# EAGLE design RxT6 (EAGLE 4.13)
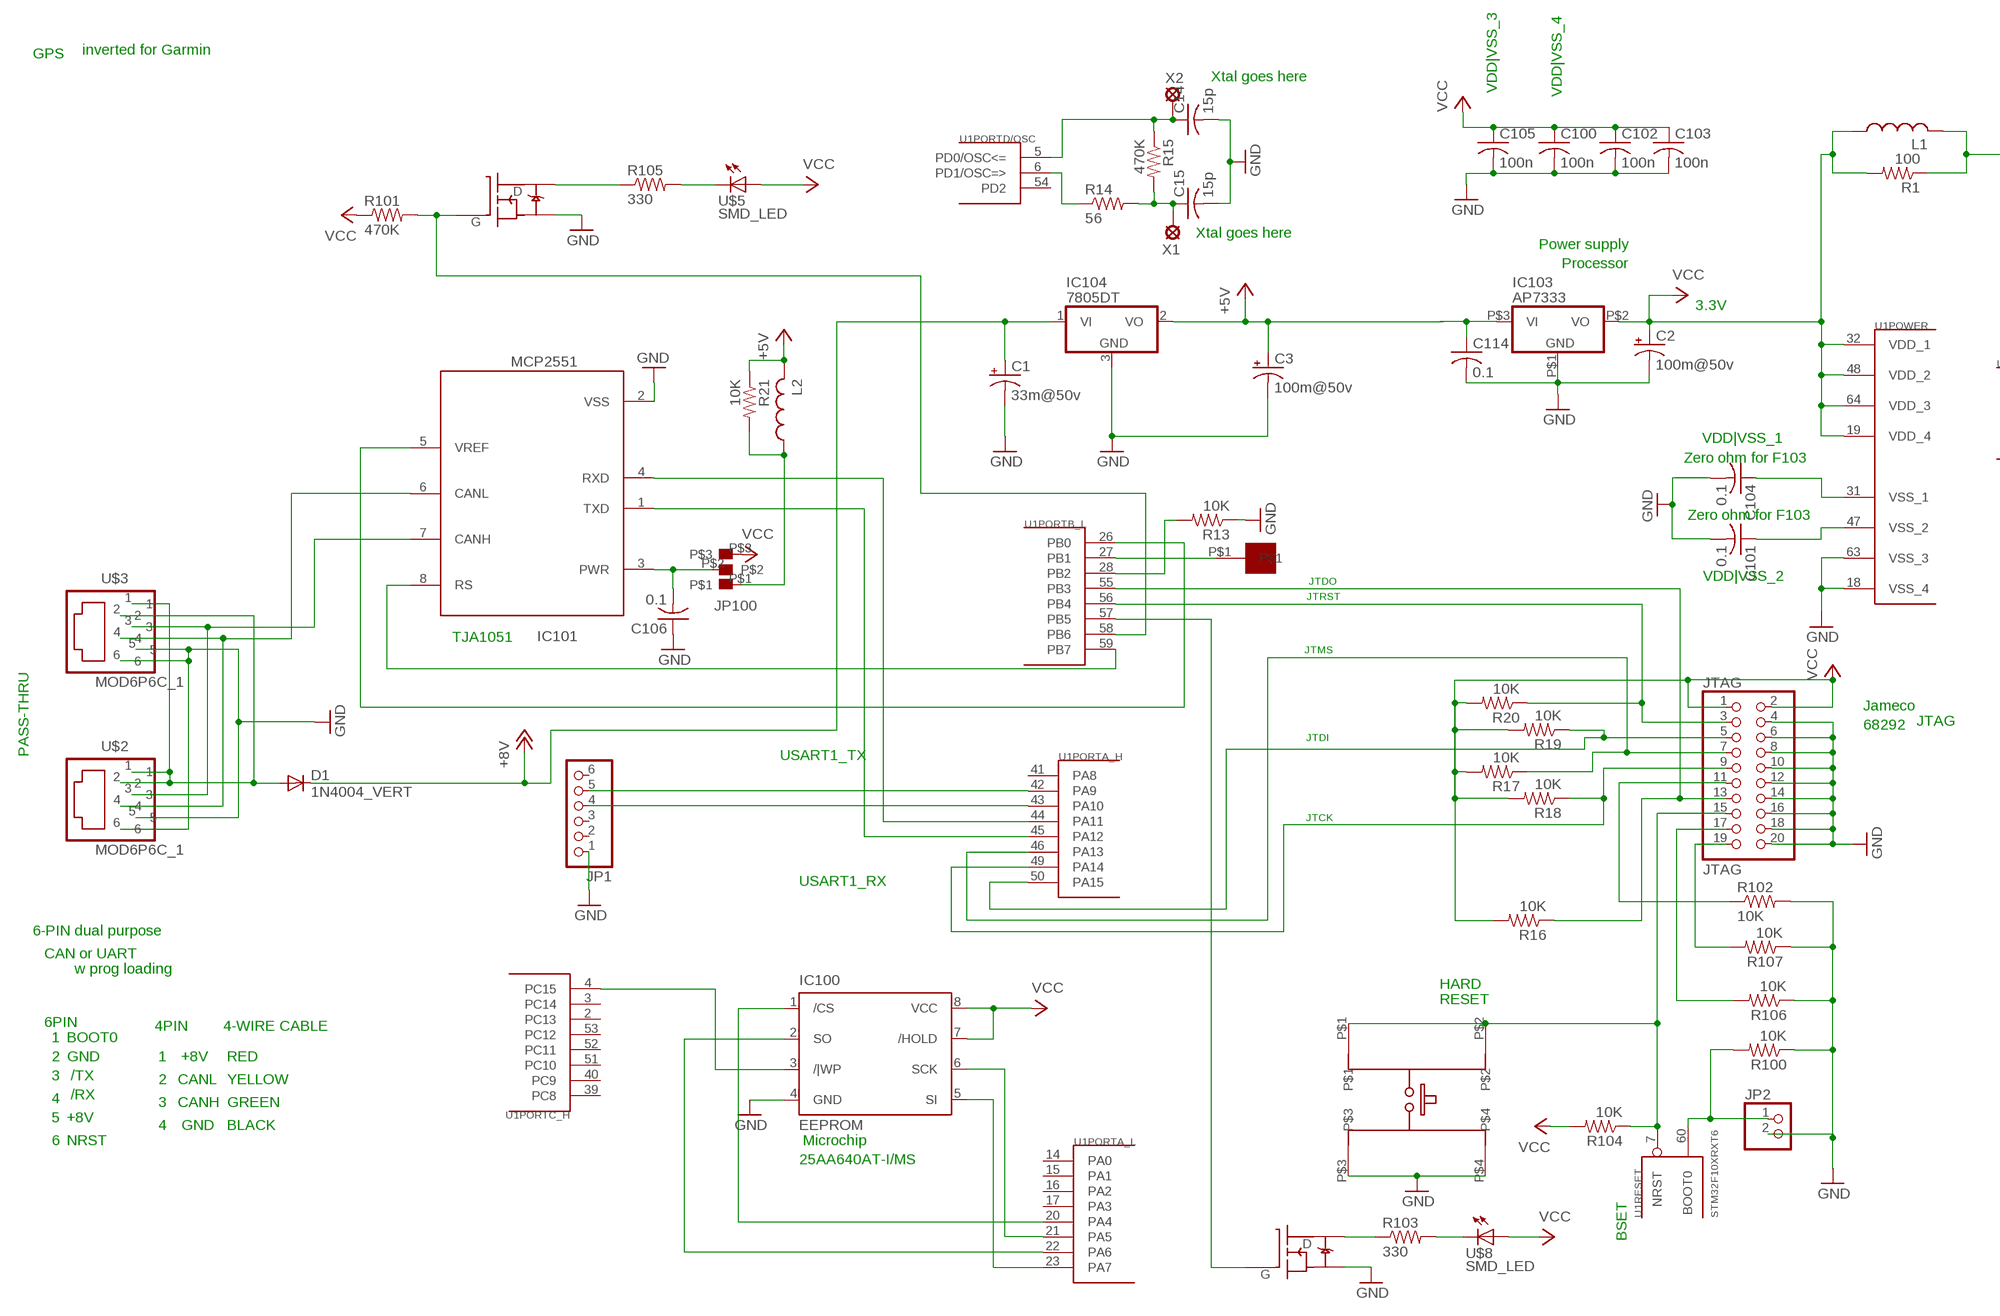
[diagram p0: schematic, sheet 1, part 1 of 2]
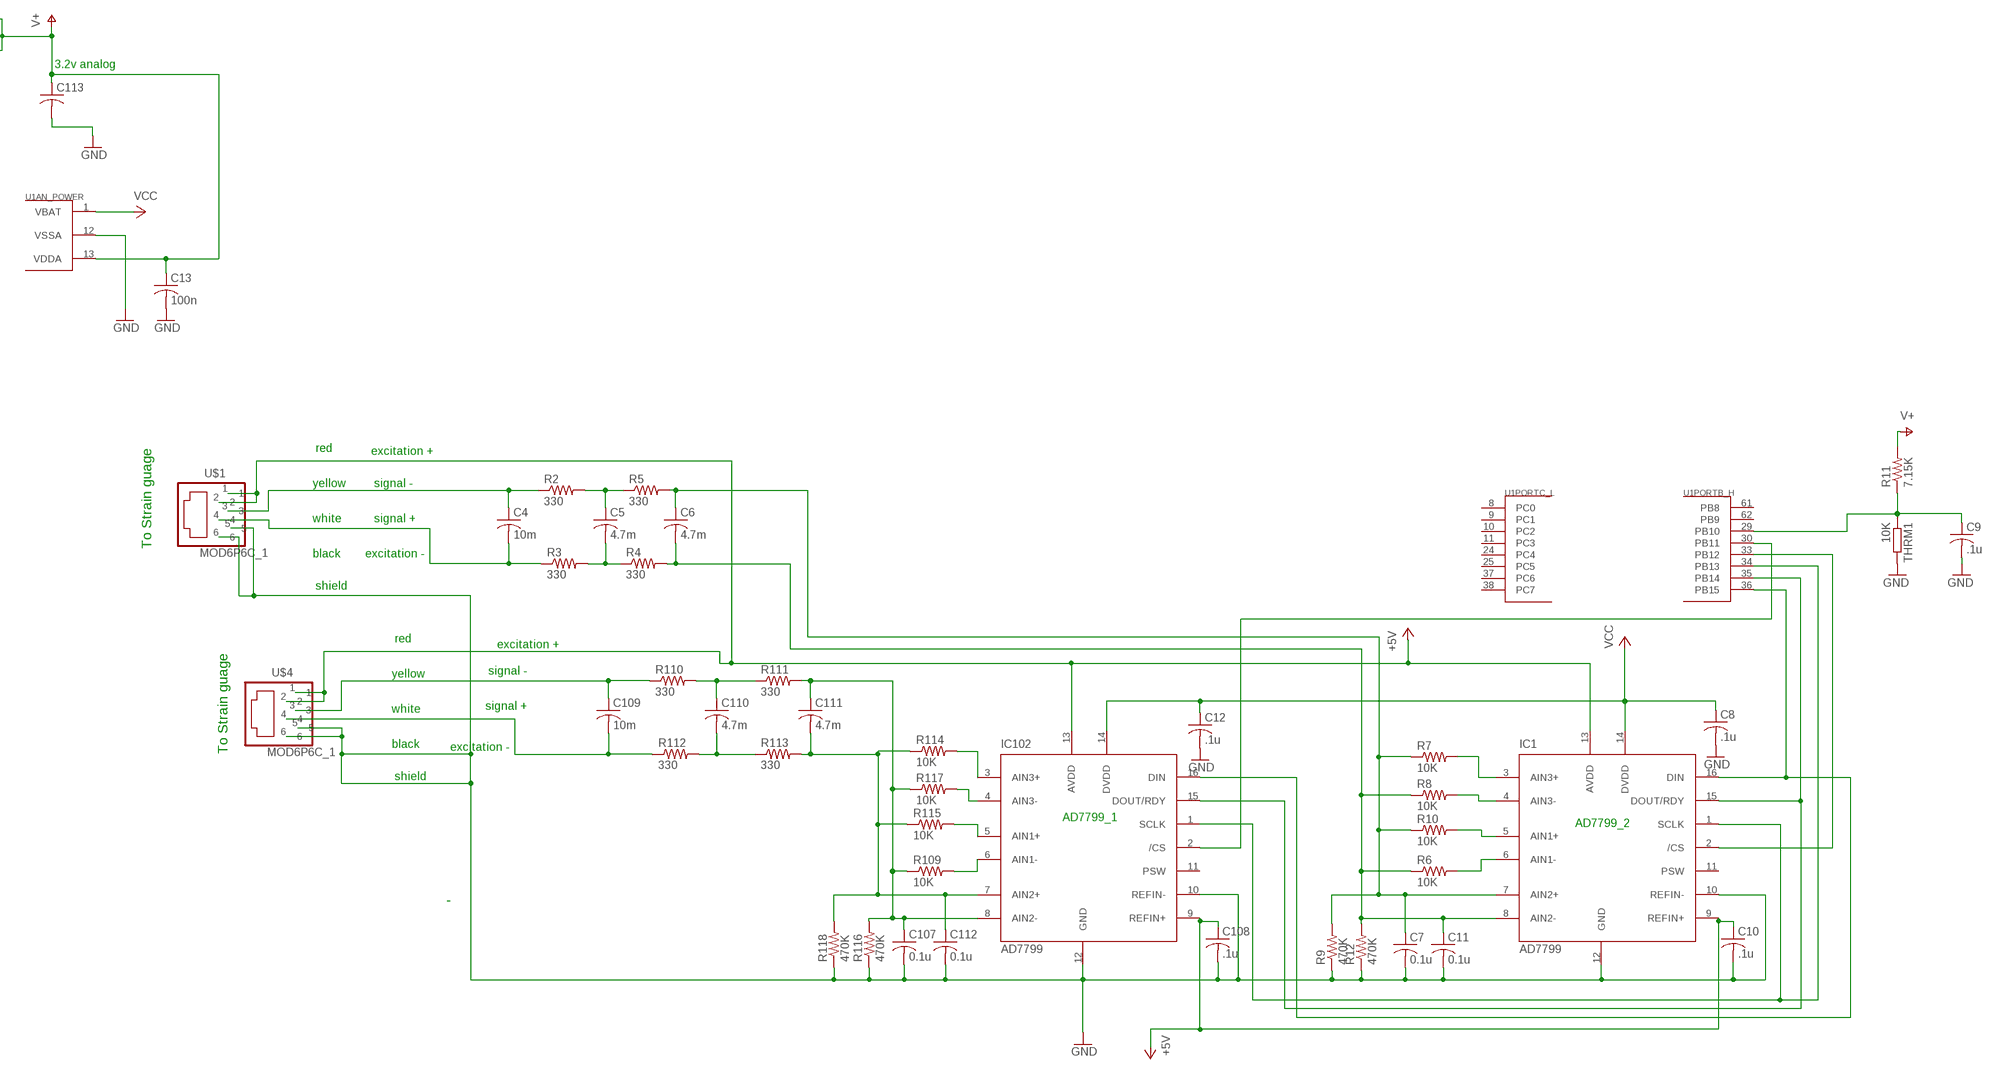
[diagram p1: schematic, sheet 1, part 2 of 2]

## Parts
C1  33m@50v  CPOL-USE5-6  [E5-6]
C2  100m@50v  CPOL-USE5-8.5  [E5-8,5]
C3  100m@50v  CPOL-USE5-8.5  [E5-8,5]
C4  10m  C-USC0805  [C0805]
C5  4.7m  C-USC0805  [C0805]
C6  4.7m  C-USC0805  [C0805]
C7  0.1u  C-USC0603  [C0603]
C8  .1u  C-USC0603  [C0603]
C9  .1u  C-USC0603  [C0603]
C10  .1u  C-USC0603  [C0603]
C11  0.1u  C-USC0603  [C0603]
C12  .1u  C-USC0603  [C0603]
C13  100n  C-USC0603  [C0603]
C14  15p  C-USC0603  [C0603]
C15  15p  C-USC0603  [C0603]
C100  100n  C-USC0603  [C0603]
C101  0.1  C-USC0603  [C0603]
C102  100n  C-USC0603  [C0603]
C103  100n  C-USC0603  [C0603]
C104  0.1  C-USC0603  [C0603]
C105  100n  C-USC0603  [C0603]
C106  0.1  C-USC0603  [C0603]
C107  0.1u  C-USC0603  [C0603]
C108  .1u  C-USC0603  [C0603]
C109  10m  C-USC0805  [C0805]
C110  4.7m  C-USC0805  [C0805]
C111  4.7m  C-USC0805  [C0805]
C112  0.1u  C-USC0603  [C0603]
C113  C-USC0603  [C0603]
C114  0.1  C-USC0603  [C0603]
D1  1N4004_VERT  [DO41-10_VERT]
IC1  AD7799  [TSSPO16]
IC100  EEPROM  [TSSOP8]
IC101  MCP2551  [SO-08]
IC102  AD7799  [TSSPO16]
IC103  AP7333  MCP1702  [SOT-23A]
IC104  7805DT  [TO252]
JP1  PINHD-1X6  [1X06]
JP2  PINHD-1X2  [1X02]
JP100  SMD-3  [SMD_3]
JTAG  JTAG  PINHD-2X10_KEYED  [2X10_KEYED]
L1  L-USL1812  [L1812]
L2  L-USL1812  [L1812]
Q100  IRLML2060  [SOT-23]
Q101  IRLML2060  [SOT-23]
R1  100  R-US_R0603  [R0603]
R2  330  R-US_R0603  [R0603]
R3  330  R-US_R0603  [R0603]
R4  330  R-US_R0603  [R0603]
R5  330  R-US_R0603  [R0603]
R6  10K  R-US_R0603  [R0603]
R7  10K  R-US_R0603  [R0603]
R8  10K  R-US_R0603  [R0603]
R9  470K  R-US_R0603  [R0603]
R10  10K  R-US_R0603  [R0603]
R11  7.15K  R-US_R0603  [R0603]
R12  470K  R-US_R0603  [R0603]
R13  10K  R-US_R0603  [R0603]
R14  56  R-US_R0603  [R0603]
R15  470K  R-US_R0603  [R0603]
R16  10K  R-US_R0603  [R0603]
R17  10K  R-US_R0603  [R0603]
R18  10K  R-US_R0603  [R0603]
R19  10K  R-US_R0603  [R0603]
R20  10K  R-US_R0603  [R0603]
R21  10K  R-US_R0603  [R0603]
R100  10K  R-US_R0603  [R0603]
R101  470K  R-US_R0603  [R0603]
R102  10K  R-US_R0603  [R0603]
R103  330  R-US_R0603  [R0603]
R104  10K  R-US_R0603  [R0603]
R105  330  R-US_R0603  [R0603]
R106  10K  R-US_R0603  [R0603]
R107  10K  R-US_R0603  [R0603]
R109  10K  R-US_R0603  [R0603]
R110  330  R-US_R0603  [R0603]
R111  330  R-US_R0603  [R0603]
R112  330  R-US_R0603  [R0603]
R113  330  R-US_R0603  [R0603]
R114  10K  R-US_R0603  [R0603]
R115  10K  R-US_R0603  [R0603]
R116  470K  R-US_R0603  [R0603]
R117  10K  R-US_R0603  [R0603]
R118  470K  R-US_R0603  [R0603]
S1  SMD_1  [SMD_1]
SW1  E-SWITCH  [E-SWITCH]
THRM1  10K  R-EU_R0603  [R0603]
U1  STM32F10XRXT6  [TQFP64]
U$1  MOD6P6C_1  [MOD6P6C_1]
U$2  MOD6P6C_1  [MOD6P6C_1]
U$3  MOD6P6C_1  [MOD6P6C_1]
U$4  MOD6P6C_1  [MOD6P6C_1]
U$5  SMD_LED  [SMD_LED]
U$8  SMD_LED  [SMD_LED]
X1  SOLPAD035  [SOLDPAD035]
X2  SOLPAD035  [SOLDPAD035]

## Nets
+5V: C3.+ C10.1 C108.1 C114.1 IC1.9(REFIN+) IC1.13(AVDD) IC102.9(REFIN+) IC102.13(AVDD) IC103.P$3(VI) IC104.2(VO) L2.2 R21.1 U$1.1 U$1.2 U$4.1 U$4.2
+8V: C1.+ D1.C IC104.1(VI)
+V_RAW: D1.A U$2.1 U$2.2 U$3.1 U$3.2
AD7799_1_AIN1+: IC102.5(AIN1+) R115.2
AD7799_1_AIN1-: IC102.6(AIN1-) R109.2
AD7799_2_AIN1+: IC1.5(AIN1+) R10.2
AD7799_2_AIN1-: IC1.6(AIN1-) R6.2
AD7799_2_AIN3+: IC1.3(AIN3+) R7.2
AD7799_2_AIN3-: IC1.4(AIN3-) R8.2
BOOT0: JP2.1 R100.2 U1.60(RESET:BOOT0)
BRDIGE1_YELLOW_AIN1-: C107.1 C111.1 IC102.8(AIN2-) R109.1 R111.2 R116.2 R117.1
BRDIGE2_YELLOW_AIN1+: C6.1 C7.1 IC1.7(AIN2+) R5.2 R7.1 R9.2 R10.1
BRIDGE1_FILTER+_2: C110.2 R112.2 R113.1
BRIDGE1_FILTER-_2: C110.1 R110.2 R111.1
BRIDGE1_WHITE_AIN2+: C111.2 C112.1 IC102.7(AIN2+) R113.2 R114.1 R115.1 R118.2
BRIDGE1_WHITE_SIG+: C109.2 R112.1 U$4.4
BRIDGE1_YELLOW_SIG-: C109.1 R110.1 U$4.3
BRIDGE2_FILTER+_2: C5.2 R3.2 R4.1
BRIDGE2_FILTER-_2: C5.1 R2.2 R5.1
BRIDGE2_WHITE_AIN1-: C6.2 C11.1 IC1.8(AIN2-) R4.2 R6.1 R8.1 R12.2
BRIDGE2_WHITE_SIG+: C4.2 R3.1 U$1.4
BRIDGE2_YELLOW_SIG-: C4.1 R2.1 U$1.3
CAN_PWR: C106.2 IC101.3(PWR) JP100.P$2
CANH: IC101.7(CANH) U$2.3 U$3.3
CANL: IC101.6(CANL) U$2.4 U$3.4
EEPROM_/WP: IC100.3(/|WP) U1.4(PORTC_H:PC15)
GND: C1.- C2.- C3.- C7.2 C8.2 C9.2 C10.2 C11.2 C12.2 C13.2 C14.2 C15.2 C100.2 C101.2 C102.2 C103.2 C104.2 C105.2 C106.1 C107.2 C108.2 C112.2 C113.2 C114.2 IC1.10(REFIN-) IC1.12(GND) IC100.4(GND) IC101.2(VSS) IC102.10(REFIN-) IC102.12(GND) IC103.P$1(GND) IC104.3(GND) JP1.1 JP2.2 JTAG.4 JTAG.6 JTAG.8 JTAG.10 JTAG.12 JTAG.14 JTAG.16 JTAG.18 JTAG.20 Q100.2(S) Q101.2(S) R9.1 R12.1 R13.1 R100.1 R102.2 R106.1 R107.1 R116.1 R118.1 SW1.P$3 SW1.P$4 THRM1.2 U1.12(AN_POWER:VSSA) U1.18(POWER:VSS_4) U1.63(POWER:VSS_3) U$1.5 U$1.6 U$2.5 U$2.6 U$3.5 U$3.6 U$4.5 U$4.6
JTAG_R-TO-GND-11: JTAG.11 R102.1
JTAG_R-TO-GND-17: JTAG.17 R106.2
JTAG_R-TO-GND-19: JTAG.19 R107.2
JTDO: JTAG.13 R16.1 U1.55(PORTB_L:PB3)
JTRST: JTAG.3 R20.1 U1.56(PORTB_L:PB4)
N$1: IC102.4(AIN3-) R117.2
N$2: IC102.3(AIN3+) R114.2
N$3: JP100.P$1 L2.1 R21.2
NRST: JTAG.15 R104.1 SW1.P$1 SW1.P$2 U1.7(RESET:NRST)
PA3_ADC123_IN3|THERMISTOR_32KHZ: C9.1 R11.1 THRM1.1 U1.29(PORTB_H:PB10)
PA4_EEPROM_/CS: IC100.1(/CS) U1.20(PORTA_L:PA4)
PA5_EEPROM_SCK: IC100.6(SCK) U1.21(PORTA_L:PA5)
PA6_EEPROM_SI: IC100.5(SI) U1.23(PORTA_L:PA7)
PA7_EEPROM_SO: IC100.2(SO) U1.22(PORTA_L:PA6)
PA9_USART1_TX: JP1.5 U1.42(PORTA_H:PA9)
PA10_USART1_RX: JP1.4 U1.43(PORTA_H:PA10)
PA11_CANRXD: IC101.4(RXD) U1.44(PORTA_H:PA11)
PA12_CANTXD: IC101.1(TXD) U1.45(PORTA_H:PA12)
PA13_JTIMS: JTAG.7 R17.1 U1.46(PORTA_H:PA13)
PA14_JTCK: JTAG.9 R18.1 U1.49(PORTA_H:PA14)
PA15_JTDI: JTAG.5 R19.1 U1.50(PORTA_H:PA15)
PAB13_SPI2_SCK_AD7799_SCK: IC1.1(SCLK) IC102.1(SCLK) U1.34(PORTB_H:PB13)
PB0_CAN_VREF: IC101.5(VREF) U1.26(PORTB_L:PB0)
PB1: S1.P$1 U1.27(PORTB_L:PB1)
PB2_BOOT1: R13.2 U1.28(PORTB_L:PB2)
PB5_LED: Q100.1(G) U1.57(PORTB_L:PB5)
PB6_LED_GREEN: Q101.1(G) R101.2 U1.58(PORTB_L:PB6)
PB7_CAN_RS: IC101.8(RS) U1.59(PORTB_L:PB7)
PB11_AD7799_1_/CS: IC102.2(/CS) U1.30(PORTB_H:PB11)
PB12_AD7799_2_/CS: IC1.2(/CS) U1.33(PORTB_H:PB12)
PB14_SPI2_MISO_AD7799_DOUT/RDY: IC1.15(DOUT/RDY) IC102.15(DOUT/RDY) U1.35(PORTB_H:PB14)
PB15_PWRLED: R105.2 U$5.C
PB15_PWRLED_D: Q101.3(D) R105.1
PB15_SPI1_MOSI_AD7799_DIN: IC1.16(DIN) IC102.16(DIN) U1.36(PORTB_H:PB15)
PC5_LED2: R103.2 U$8.C
PC5_LED_D: Q100.3(D) R103.1
PD0_OSC_IN_XTAL: C14.1 R15.1 U1.5(PORTD/OSC:PD0/OSC<=) X2.MP
PD1_OSC_OUT: R14.1 U1.6(PORTD/OSC:PD1/OSC=>)
PD1_OSC_OUT_XTAL: C15.1 R14.2 R15.2 X1.MP
V+: C13.1 C113.1 L1.2 R1.1 R11.2 U1.13(AN_POWER:VDDA)
VCC: C2.+ C8.1 C12.1 C100.1 C102.1 C103.1 C105.1 IC1.14(DVDD) IC100.7(/HOLD) IC100.8(VCC) IC102.14(DVDD) IC103.P$2(VO) JP100.P$3 JTAG.1 JTAG.2 L1.1 R1.2 R16.2 R17.2 R18.2 R19.2 R20.2 R101.1 R104.2 U1.1(AN_POWER:VBAT) U1.19(POWER:VDD_4) U1.32(POWER:VDD_1) U1.48(POWER:VDD_2) U1.64(POWER:VDD_3) U$5.A U$8.A
VSS_1: C104.1 U1.31(POWER:VSS_1)
VSS_2: C101.1 U1.47(POWER:VSS_2)
Unconnected: IC1.11(PSW) IC102.11(PSW) JP1.2 JP1.3 JP1.6 U1.2(PORTC_H:PC13) U1.3(PORTC_H:PC14) U1.8(PORTC_L:PC0) U1.9(PORTC_L:PC1) U1.10(PORTC_L:PC2) U1.11(PORTC_L:PC3) U1.14(PORTA_L:PA0) U1.15(PORTA_L:PA1) U1.16(PORTA_L:PA2) U1.17(PORTA_L:PA3) U1.24(PORTC_L:PC4) U1.25(PORTC_L:PC5) U1.37(PORTC_L:PC6) U1.38(PORTC_L:PC7) U1.39(PORTC_H:PC8) U1.40(PORTC_H:PC9) U1.41(PORTA_H:PA8) U1.51(PORTC_H:PC10) U1.52(PORTC_H:PC11) U1.53(PORTC_H:PC12) U1.54(PORTD/OSC:PD2) U1.61(PORTB_H:PB8) U1.62(PORTB_H:PB9)

## Notes on the sheet
- GPS | inverted for Garmin
- Xtal goes here
- VDD|VSS_3 | VDD|VSS_4
- 3.2v analog
- Xtal goes here
- Power supply
- Processor
- 3.3V
- VDD|VSS_1
- Zero ohm for F103
- Zero ohm for F103
- JTDO
- VDD|VSS_2
- JTRST
- TJA1051
- JTMS
- red | excitation +
- Jameco
- 68292 | JTAG
- JTDI
- yellow | signal -
- PASS-THRU | USART1_TX
- white | signal +
- JTCK
- To Strain guage
- black | excitation -
- shield
- USART1_RX
- 6-PIN dual purpose
- red
- excitation +
- CAN or UART
- w prog loading
- HARD | yellow | signal -
- RESET
- 6PIN | 4PIN | 4-WIRE CABLE | signal +
- white
- 1 | BOOT0
- 2 | GND | 1 | +8V | RED
- 3 | /TX | 2 | CANL | YELLOW | black | excitation -
- To Strain guage
- 4 | /RX
- 3 | CANH | GREEN
- 5 | +8V | shield
- 4 | GND | BLACK
- 6 | NRST | Microchip
- 25AA640AT-I/MS
- AD7799_1
- AD7799_2
- BSET

## Library data of the parts
C1-C3 = rcl:CPOL-US: POLARIZED CAPACITOR, American symbol
C4-C15 C100-C114 = rcl:C-US: CAPACITOR, American symbol
D1 = diode:1N4004_VERT
IC1 IC102 = texas:AD7799
IC100 = texas:EEPROM
IC101 = texas:MCP2551
IC103 = linear:MCP1702
IC104 = linear:78*: Positive VOLTAGE REGULATOR
JP1 = pinhead:PINHD-1X6: PIN HEADER
JP2 = pinhead:PINHD-1X2: PIN HEADER
JP100 = solpad:SMD-3
JTAG = pinhead:PINHD-2X10_KEYED
L1 L2 = rcl:L-US: INDUCTOR, American symbol
Q100 Q101 = transistor-fet:IRLML2060
R1-R21 R100-R107 R109-R118 = rcl:R-US_: RESISTOR, American symbol
S1 = solpad:SMD_1
SW1 = switch-misc:E-SWITCH
THRM1 = rcl:R-EU_: RESISTOR, European symbol
U1 = stm32:STM32F10XRXT6: STM32F101/103 64pin LQFP
U$1-U$4 = DEH:MOD6P6C_1
U$5 U$8 = led:SMD_LED
X1 X2 = solpad:SOLPAD035

## Board
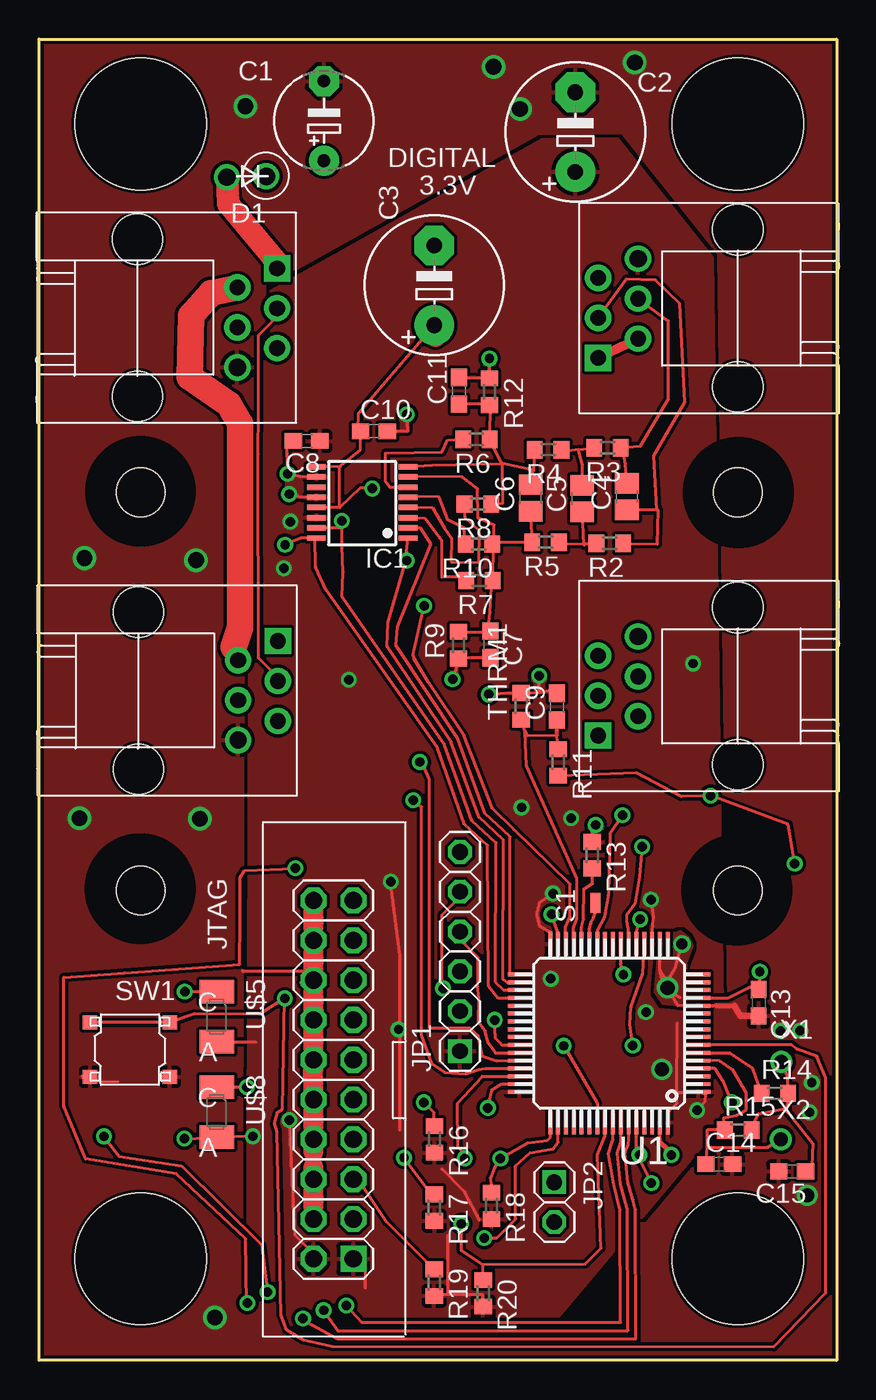
[diagram p2: board, top side]
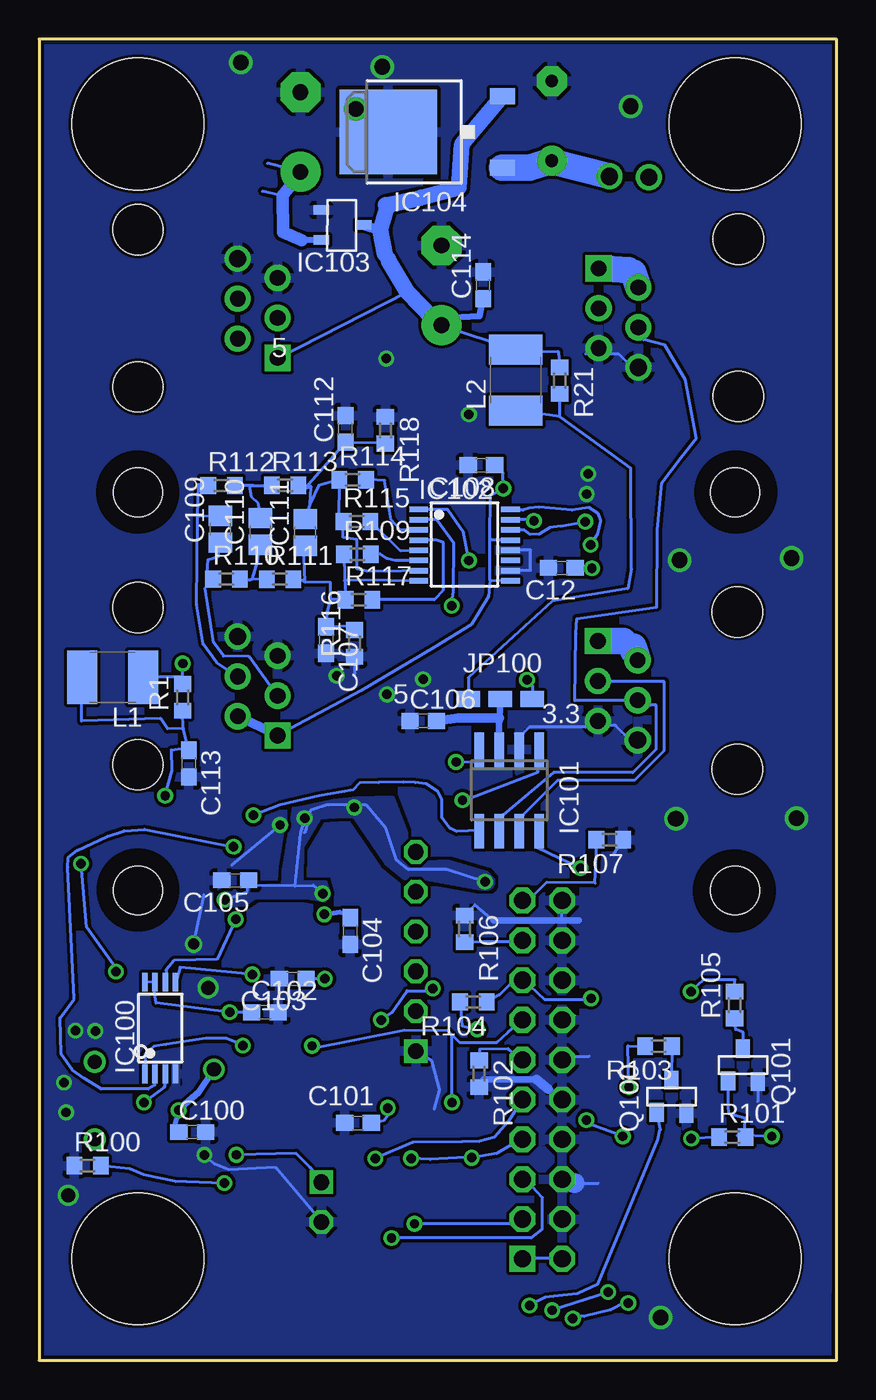
[diagram p3: board, bottom side, seen from below]

Size 50.88 x 84.28 mm. Coordinates in mm from the lower left corner, seen from the top.
Outline: 0,0 0,84.28 50.88,84.28 50.88,0 0,0
Copper layers (1*16): Top 0.035mm / dielectric 1.5mm / Bottom 0.035mm
Design rules "default": minimum track width 8mil, minimum drill 0.6mm, track to track 0.2083mm, track to pad 8mil, pad to pad 8mil, via to via 8mil, smd to smd 0mil, copper to edge 8mil, drill to drill 8mil, minimum pad ring 10mil, minimum via ring 8mil, stop-mask expansion 4mil, vias tented up to drill 0mil, thermal gap 10mil
Holes 8.4 mm at 6.48,6.48 44.58,6.48 6.48,78.87 44.58,78.87
Holes 3.1 mm at 6.48,29.97 6.48,55.37 44.58,29.97 44.58,55.37
tRestrict: area 41.2,51.9 to 48.1,58.8; area 41.1,26.6 to 47.9,33.4; area 3,26.7 to 9.9,33.5; area 3,52 to 9.9,58.9
bRestrict: area 4,27.4 to 9.1,32.5; area 3.9,52.9 to 9,57.9; area 42.1,52.9 to 47.1,57.9; area 42,27.5 to 47.1,32.6

### Footprints (pad centres in the part's own frame; a part is rotated, then mirrored left to right if it is on the bottom)
E5-6 = drill 0.8 pad 1.905 round: + -2.54,0 | drill 0.8 pad 1.905 octagon: - 2.54,0
E5-8,5 = drill 1 pad 2.54 round: + -2.54,0 | drill 1 pad 2.54 octagon: - 2.54,0
C0805 = smd 1.3 x 1.5: 1 -0.85,0; 2 0.85,0
C0603 = smd 1.1 x 1: 1 -0.85,0; 2 0.85,0
DO41-10_VERT = drill 1.1 round: A 2.58,0.05; C 0.07,0
TSSPO16 = smd 0.35 x 1.2: 1 -0.975,-3.025; 2 -0.325,-3.025; 3 0.325,-3.025; 4 0.975,-3.025; 5 1.625,-3.025; 6 2.275,-3.025; 7 2.925,-3.025; 8 3.575,-3.025; 9 3.575,2.825; 10 2.925,2.825; 11 2.275,2.825; 12 1.625,2.825; 13 0.975,2.825; 14 0.325,2.825; 15 -0.325,2.825; 16 -0.975,2.825
TSSOP8 = smd 1.2 x 0.35: 1 -2.925,0.975; 2 -2.925,0.325; 3 -2.925,-0.325; 4 -2.925,-0.975; 5 2.925,-0.975; 6 2.925,-0.325; 7 2.925,0.325; 8 2.925,0.975
SO-08 = smd 0.6 x 2.2: 1 -1.905,-2.6; 2 -0.635,-2.6; 3 0.635,-2.6; 4 1.905,-2.6; 5 1.905,2.6; 6 0.635,2.6; 7 -0.635,2.6; 8 -1.905,2.6
SOT-23A = smd 0.6 x 1: P$1 -0.95,-1.35; P$2 0.95,-1.35; P$3 0,1.35
TO252 = smd 1 x 1.6: 1 -2.28,-4.8; 2 2.28,-4.8 | smd 5.4 x 6.2: 3 0,2.5
1X06 = drill 1 square: 1 -6.35,0 | drill 1 octagon: 2 -3.81,0; 3 -1.27,0; 4 1.27,0; 5 3.81,0; 6 6.35,0
1X02 = drill 1 square: 1 -1.27,0 | drill 1 octagon: 2 1.27,0
SMD_3 = smd 1.5 x 1: P$1 -2.04,-0.27; P$2 0,-0.27; P$3 2.04,-0.27
2X10_KEYED = drill 1.1 square: 1 -11.46,-1.27 | drill 1.1 octagon: 2 -11.46,1.27; 3 -8.92,-1.27; 4 -8.92,1.27; 5 -6.38,-1.27; 6 -6.38,1.27; 7 -3.84,-1.27; 8 -3.84,1.27; 9 -1.3,-1.27; 10 -1.3,1.27; 11 1.24,-1.27; 12 1.24,1.27; 13 3.78,-1.27; 14 3.78,1.27; 15 6.32,-1.27; 16 6.32,1.27; 17 8.86,-1.27; 18 8.86,1.27; 19 11.4,-1.27; 20 11.4,1.27
L1812 = smd 1.9 x 3.4: 1 -1.95,0; 2 1.95,0
SOT-23 = smd 0.9 x 1.2: 1 -1,-1.006; 2 0.9,-1.056; 3 -0.05,1.056
R0603 = smd 1 x 1.1: 1 -0.85,0; 2 0.85,0
SMD_1 = smd 1.27 x 0.635: P$1 0,0
E-SWITCH = smd 0.9 x 0.9: P$1 -2.55,1.75; P$2 2.55,1.75; P$3 -2.55,-1.75; P$4 2.55,-1.75
TQFP64 = smd 1.5 x 0.25: 1 -5.7,3.75; 2 -5.7,3.25; 3 -5.7,2.75; 4 -5.7,2.25; 5 -5.7,1.75; 6 -5.7,1.25; 7 -5.7,0.75; 8 -5.7,0.25; 9 -5.7,-0.25; 10 -5.7,-0.75; 11 -5.7,-1.25; 12 -5.7,-1.75; 13 -5.7,-2.25; 14 -5.7,-2.75; 15 -5.7,-3.25; 16 -5.7,-3.75; 33 5.7,-3.75; 34 5.7,-3.25; 35 5.7,-2.75; 36 5.7,-2.25; 37 5.7,-1.75; 38 5.7,-1.25; 39 5.7,-0.75; 40 5.7,-0.25; 41 5.7,0.25; 42 5.7,0.75; 43 5.7,1.25; 44 5.7,1.75; 45 5.7,2.25; 46 5.7,2.75; 47 5.7,3.25; 48 5.7,3.75 | smd 0.25 x 1.5: 17 -3.75,-5.7; 18 -3.25,-5.7; 19 -2.75,-5.7; 20 -2.25,-5.7; 21 -1.75,-5.7; 22 -1.25,-5.7; 23 -0.75,-5.7; 24 -0.25,-5.7; 25 0.25,-5.7; 26 0.75,-5.7; 27 1.25,-5.7; 28 1.75,-5.7; 29 2.25,-5.7; 30 2.75,-5.7; 31 3.25,-5.7; 32 3.75,-5.7; 49 3.75,5.7; 50 3.25,5.7; 51 2.75,5.7; 52 2.25,5.7; 53 1.75,5.7; 54 1.25,5.7; 55 0.75,5.7; 56 0.25,5.7; 57 -0.25,5.7; 58 -0.75,5.7; 59 -1.25,5.7; 60 -1.75,5.7; 61 -2.25,5.7; 62 -2.75,5.7; 63 -3.25,5.7; 64 -3.75,5.7
MOD6P6C_1 = drill 1 pad 1.676 square: 1 -3.175,8.898 | drill 1 pad 1.676 round: 2 -1.951,6.358; 3 -0.627,8.898; 4 0.597,6.358; 5 1.921,8.898 | drill 1.1 pad 1.676 round: 6 3.145,6.358 | hole 3.2: -5.029,-0.01; 4.999,-0.01
SMD_LED = smd 2.2 x 1.5: A 0,1.6; C 0,-1.6
SOLDPAD035 = drill 0.9 pad 1.27 round: MP 0,0

### Placement (x,y rotation side)
C1  18.17,79.07 90 top
C2  34.21,78.36 90 top
C3  25.21,68.58 90 top
C4  37.5,55.1 90 top
C5  34.66,54.98 90 top
C6  31.35,55.02 90 top
C7  28.8,45.67 270 top
C8  17.06,58.65 180 top
C9  33.04,41.7 90 top
C10  21.36,59.27 0 top
C11  26.79,61.85 90 top
C12  17.53,50.55 180 bottom
C13  45.91,22.82 270 top
C14  43.39,12.51 0 top
C15  48.05,12.06 180 top
C100  41.12,14.57 0 bottom
C101  30.54,15.15 180 bottom
C102  36.48,22.2 0 bottom
C103  34.7,24.34 180 bottom
C104  31.03,27.39 270 bottom
C105  38.37,30.62 180 bottom
C106  26.37,40.79 0 bottom
C107  32.57,45.95 270 bottom
C108  22.66,57.11 180 bottom
C109  39.32,53.02 90 bottom
C110  36.77,52.88 90 bottom
C111  33.91,52.82 90 bottom
C112  31.33,59.42 90 bottom
C113  41.33,38.07 270 bottom
C114  22.55,68.58 90 bottom
D1  14.56,75.53 180 top
IC1  20.51,53.43 90 top
IC100  43.16,21.2 90 bottom
IC101  20.89,36.36 180 bottom
IC102  23.64,53.3 270 bottom
IC103  31.52,72.43 270 bottom
IC104  26.11,78.36 90 bottom
JP1  26.85,26.08 90 top
JP2  32.87,10.09 270 top
JP100  21.45,42.46 0 bottom
JTAG  18.78,17.93 90 top
L1  46.19,43.58 180 bottom
L2  20.47,62.53 90 bottom
Q100  10.48,16.82 0 bottom
Q101  5.92,18.83 0 bottom
R1  41.72,42.29 90 bottom
R2  36.41,52.12 180 top
R3  36.26,58.21 180 top
R4  32.47,58.09 180 top
R5  32.31,52.19 180 top
R6  27.9,58.75 180 top
R7  28.09,49.74 180 top
R8  27.99,54.62 180 top
R9  26.76,45.62 90 top
R10  28.06,52.07 180 top
R11  33.12,38.14 270 top
R12  28.74,61.79 270 top
R13  35.29,32.22 270 top
R14  46.94,17.03 0 top
R15  44.6,14.69 0 top
R16  25.23,14.1 270 top
R17  25.21,9.74 270 top
R18  28.85,9.86 270 top
R19  25.21,4.96 270 top
R20  28.33,4.28 270 top
R21  17.67,62.5 270 bottom
R100  47.79,12.42 0 bottom
R101  6.65,14.24 0 bottom
R102  22.81,18.28 270 bottom
R103  11.36,20.04 180 bottom
R104  23.18,22.86 180 bottom
R105  6.51,22.66 90 bottom
R106  23.73,27.52 270 bottom
R107  14.47,33.21 180 bottom
R109  30.58,51.42 0 bottom
R110  38.93,49.84 0 bottom
R111  35.51,49.83 0 bottom
R112  39.25,55.81 0 bottom
R113  35.19,55.82 0 bottom
R114  30.87,56.17 0 bottom
R115  30.61,53.5 0 bottom
R116  30.75,45.74 90 bottom
R117  30.48,48.52 0 bottom
R118  28.79,59.33 270 bottom
S1  35.48,29.19 90 top
SW1  5.79,19.82 0 top
THRM1  30.76,41.72 90 top
U1  36.36,20.87 180 top
U$1  44.57,67.13 90 top
U$2  6.29,66.49 270 top
U$3  6.34,42.71 270 top
U$4  44.57,43.03 90 top
U$5  11.33,21.92 180 top
U$8  11.33,15.83 180 top
X1  47.35,19.04 0 top
X2  47.33,14.1 0 top

### Tracks (layer width: path | path; a pad name or v marks a point on that pad's centre or on a via)
+5V  (via drill 0.6)
  Top 0.203: 19.18,54.39 IC1.13 | 19.18,54.39 19.18,57 19.22,56.99 19.15,56.99 | 19.15,56.99 IC1.9 | C3.+ 25.19,66.03 20.39,60.42 20.35,59.3 C10.1 20.49,58.08 19.15,56.98 19.15,56.99 | 19.18,54.39 20.46,55.64 21.27,55.64 v21.26,55.62
  Top 0.61: U$1.2 38.23,65.19 U$1.1
  Top 1.27: 25.3,65.3 25.3,65.35 C3.+
  Bottom 0.203: C3.+ 25.21,65.94 | C3.+ 25.25,66.02 | C3.+ 25.33,65.96 | 22.11,52.4 22.03,52.36 20.81,52.35 IC102.13 | 22.11,52.4 22.09,55.2 v21.26,55.62 21.27,55.6 21.28,56.6 | IC102.9 22.13,49.75 22.13,49.78 | 22.11,52.4 22.11,52.42 22.13,49.78 | 21.28,56.6 C108.1 | 21.28,56.6 21.74,57.09 | C3.+ 25.24,66.05 L2.2 20.37,64.41 17.76,64.35 R21.1 | U$1.1 35.68,63.89 27.37,68.13 | U$4.1 30.37,42.71 25.68,45.48 23.3,46.94 22.2,48.72 22.13,49.78 | 22.13,49.78
  Bottom 0.406: C3.+ 25.74,66.44 22.79,66.6 22.59,67.61 C114.1 | 29.1,72.05 29.06,72.05
  Bottom 0.61: 29.1,72.05 IC103.P$3 | 28.61,70.22 28.82,70.57 | U$4.2 38.3,41.17 U$4.1
  Bottom 0.813: 29.1,72.05 29.1,72.09 | 28.66,73.64 28.72,73.72 28.76,73.7
  Bottom 1.016: 29.1,72.09 28.66,73.64 | IC104.2 23.89,77.59 24.1,74.82 26.51,74.18 28.76,73.7 | 25.74,66.44 27.37,68.13 28.61,70.22 | 28.82,70.57 29.1,72.05
+8V
  Bottom 1.676: D1.C 18.25,76.49 C1.+ 19.61,76.09 21.34,76.09 IC104.1
+V_RAW
  Top 0.203: U$2.1 15.2,70
  Top 0.813: U$3.2 12.4,45.5
  Top 1.422: 15.2,70 12.04,73.78 D1.A
  Top 1.676: 12.4,45.5 12.82,46.75 12.81,59.76 12.09,61.01 9.6,62.73 9.69,66.66 10.97,68.09 U$2.2
  Bottom 0.203: 12.96,45.53 13.35,44.98 | 12.95,69.38 13.5,68.9 13.29,69.56
  Bottom 0.813: 13.35,44.98 13.61,45.88
  Bottom 1.676: U$3.2 12.96,45.53 | 13.61,45.88 U$3.1 | U$2.2 12.95,69.38 | 13.29,69.56 U$2.1
AD7799_1_AIN1+
  Bottom 0.203: IC102.5 27.81,51.64 29.71,53.49 R115.2
AD7799_1_AIN1-
  Bottom 0.203: IC102.6 28.19,51.03 28.68,51.16 29.09,51.42 R109.2
AD7799_2_AIN1+
  Top 0.203: IC1.5 25.5,55.09 26.1,53.59 27.12,53.1 R10.2
AD7799_2_AIN1-
  Top 0.203: IC1.6 22.34,55.71 22.09,56.06 22.09,57.86 25.69,57.95 26.06,58.69 26.94,58.77 R6.2
AD7799_2_AIN3+
  Top 0.203: IC1.3 24.61,53.71 25.7,52.27 25.69,49.96 27.15,49.96 R7.2
AD7799_2_AIN3-
  Top 0.203: R8.2 27.17,53.77 28.09,52.9 28.07,50.89 26.29,50.93 26.3,52.45 25.85,53.09 25.09,54.4 23.58,54.42 IC1.4
BOOT0  (via drill 0.6)
  Top 0.203: 38.1,13.2 38.1,14.5 U1.60 | 38.1,13.2 v39.06,11.3 | v38.3,13.11 38.1,13.2
  Bottom 0.203: v39.06,11.3 41.5,11.4 42.19,11.41 44.22,11.84 45.1,12.2 R100.2 | v38.3,13.11 34.5,13.2 33.6,12.3 JP2.1
BRDIGE1_YELLOW_AIN1-
  Bottom 0.203: R111.2 34.06,49.75 33.91,49.64 | C111.1 34.01,51.97 33.91,49.64 | 32.29,48.54 R117.1 31.36,49.74 | 33.91,49.64 32.29,49.63 32.29,49.25 32.29,48.54 | 30.74,46.99 R116.2 30.74,46.87 C107.1 32.5,47.76 32.32,48.5 32.29,48.54 | R109.1 31.4,51.56 31.36,49.74 | IC102.8 30.48,49.78 31.4,49.74 31.36,49.74
BRDIGE2_YELLOW_AIN1+
  Top 0.203: 29.02,52.21 R10.1 28.98,52.04 R7.1 28.9,49.84 28.77,47.72 28.65,46.47 | 29.02,52.21 R5.2 31.47,52.29 C6.1 | 28.65,46.47 C7.1 | R9.2 28.65,46.47 | 29.02,52.21 29.02,53.29 28,53.73 27.97,55.6 27,56.36 23.58,56.38 IC1.7
BRIDGE1_FILTER+_2
  Bottom 0.203: R113.1 36.35,55.79 37.2,55.8 | 37.2,55.8 R112.2 | C110.2 36.89,54.64 37.31,55.06 37.44,55.81 37.2,55.8
BRIDGE1_FILTER-_2
  Bottom 0.203: R111.1 37.21,49.88 37.5,49.79 | R110.2 37.5,49.79 | C110.1 36.94,50.97 37.26,49.88 37.5,49.79
BRIDGE1_WHITE_AIN2+
  Bottom 0.203: 33.61,54.67 C111.2 | 33.61,54.67 33.54,55.68 | 33.54,55.68 33.5,55.73 34.59,55.76 R113.2 | 33.61,54.67 33.05,55.81 R114.1 31.73,53.54 R115.1 31.46,53.43 31.49,52.49 30.6,52.36 30.59,50.49 29.96,50.34 28.8,50.33 IC102.7 | R118.2 28.85,58.56 C112.1 33.93,55.62 33.54,55.68
BRIDGE1_WHITE_SIG+
  Bottom 0.203: U$4.4 39.55,44.51 40.42,45.68 40.82,48.2 40.77,53.83 | 40.77,53.83 40.71,55.89 40.04,55.86 R112.1 | 40.77,53.83 40.64,53.89 C109.2
BRIDGE1_YELLOW_SIG-
  Bottom 0.203: C109.1 39.46,51.26 40.11,51.08 40.18,49.76 R110.1 40.28,49.27 39.76,45.8 39.12,44.93 37.49,44.89 35.63,42.31 U$4.3
BRIDGE2_FILTER+_2
  Top 0.203: R4.1 33.55,57.98 34.42,58.09 | 34.42,58.09 R3.2 | C5.2 34.67,57.15 34.43,57.98 34.42,58.09
BRIDGE2_FILTER-_2
  Top 0.203: R5.1 33.26,52.08 34.76,52.11 | 34.76,52.11 R2.2 | 34.76,52.11 34.76,52 C5.1
BRIDGE2_WHITE_AIN1-
  Top 0.203: IC1.8 25.07,57.11 29.57,57.22 29.57,57.24 | 26.83,61.09 C11.1 28.83,61 R12.2 28.81,61.1 R6.1 29.51,57.25 | 29.57,57.24 29.51,57.25 | 29.57,57.24 31.47,56.82 31.47,56.74 | C6.2 31.43,55.95 31.47,56.74 | 31.47,56.74 31.56,56.74 R4.2 | R8.1 29.57,54.67 29.53,57.26 29.51,57.25
BRIDGE2_WHITE_SIG+
  Top 0.203: U$1.4 40.16,66.3 40.16,61.31 38.37,58.32 37,58.23 R3.1 37.21,58.23 37.42,57.19 C4.2
BRIDGE2_YELLOW_SIG-
  Top 0.203: U$1.3 37.46,68.96 39.33,68.91 40.87,67.42 41.2,61.14 39.21,57.73 39.41,54.24 | C4.1 37.67,54.24 39.41,54.24 | R2.1 39.46,52.08 39.5,54.24 39.41,54.24
CAN_PWR
  Bottom 0.203: IC101.3 21.6,39.08
  Bottom 0.406: 21.6,39.08 21.51,40.98 JP100.P$2
  Bottom 0.61: 21.51,40.98 21.53,40.98 24.15,40.99 C106.2
CANH
  Top 0.203: U$2.3 14.9,66.3 14,65.4 13.99,60.55 13.97,57.81 14,44.8 14.8,44 U$3.3
  Bottom 0.203: IC101.7 20,34.8 17.8,37 12.9,37 11,38.9 11,43.3 14.4,43.3 U$3.3
CANL
  Bottom 0.203: IC101.6 21.3,34.8 18.06,37.5 13,37.5 11.5,39 11.5,41.8 11.9,41.8 U$3.4 13.5,42.1 16.7,42.09 16.62,46.35 16.57,47.31 11.48,48.04 11.44,52.98 11.16,55.98 9.92,57.6 8.96,58.82 9.65,62.56 10.96,64.77 12.3,65.1 U$2.4
EEPROM_/WP  (via drill 0.6)
  Top 0.203: v44.2,16.45 43.68,17.74 43.11,18.61 U1.4
  Bottom 0.203: IC100.3 42.82,17.67 42.86,17.45 v44.2,16.45
GND  (via drill 0.6, 0.7, 0.9, 1)
  Top 0.203: 34.86,32.63 R13.1 35.3,33.62 v35.51,34.15 | JTAG.8 17.5,14.9 | 17.5,15.9 JTAG.10 17.5,17.12 | JTAG.4 17.5,9.8 | 17.5,10.8 JTAG.6 | 17.5,12.3 17.5,13.3 | JTAG.16 17.5,25 | 17.5,26 JTAG.18 17.5,27.6 | 17.5,19.9 JTAG.12 17.49,18.56 | 17.5,21.06 JTAG.14 17.52,22.29 | 17.5,23.5 JTAG.16 | 17.5,28.6 JTAG.20 | JTAG.16 16.7,24.1 | U1.63 39.61,14.11 39.66,13.83 | v40.34,13.1 40.12,13.38 | v40.1,23.77 39.91,23.64 40.9,23.14 | 39.61,24.88 U1.18 | v40.1,23.77 39.94,23.55 39.61,24.88 | v41.02,26.55 40.58,25.04 40.06,24.07 39.61,24.88 | v40.1,23.77 40.11,23.75 40.75,22.63 U1.12 42.22,22.63 43.22,22.63 | 17.66,55.05 IC1.12 16.73,55.05 v15.95,55.26 | IC1.10 16.67,56.37 v15.85,56.55 15.86,57.01 15.83,58.24 C8.2 | C11.2 28.48,62.69 R12.1 v28.73,63.91 | C9.2 32.96,42.87 31.98,42.59 | 31.98,42.59 THRM1.2 29.74,42.57 v28.69,42.48 | 26.83,44.83 C7.2 | R9.1 26.83,44.83 | 26.83,44.83 v26.38,43.45 | SW1.P$3 2.72,18.12 4.05,17.72 Q101.2 | C10.2 23.55,59.29 v23.46,60.35 | v31.9,43.67 31.93,43.34 31.86,42.87 31.98,42.59 | 12.95,24.85 13,24.8 16.9,24.8 JTAG.16
  Top 0.305: 39.66,13.83 40,13.57 40.12,13.38 | 43.22,22.63 44.37,22.62
  Top 0.406: C13.2 44.75,21.97 44.37,22.62 | 17.5,28.6 17.51,28.2 17.35,28.11 17.36,28.1
  Top 1.27: 17.5,14.9 17.5,15.9 | 17.5,9.8 17.5,10.8 | 17.5,13.3 JTAG.8 | JTAG.6 17.5,12.3 | 17.5,25 17.5,26 | 17.5,19.9 17.5,21.06 | 17.52,22.29 17.5,23.5 | 17.5,27.6 17.5,28.6 | 17.5,17.12 17.49,18.56
  Bottom 0.203: 16,64.2 U$2.5 14.4,64.2 13.9,64.2 13.4,63.7 U$2.6 | v35.51,34.15 38.6,31.6 | JP2.2 35.8,12.3 38.78,12.16 39.71,12.53 40.36,13.1 v40.34,13.1 | 16.7,11.3 15.2,11.3 | 20.5,40 IC101.2 20,40 19.6,40.4 16,40.4 U$3.5 14.4,40.5 14.1,40.5 13.5,39.9 U$3.6 | 21.89,28.05 23.08,29.06 R106.1 | 16.44,28.07 17.57,28.2 JTAG.20 16.8,29.7 | 14.2,32.3 R107.1 | 15.8,19.4 16.7,19.4 JTAG.12 | JTAG.14 16.7,22 | 22.54,17.93 R102.2 | v41.02,26.55 40.37,29.7 | 25.68,16.04 25.35,17.31 25.83,19.1 26.88,19.74 JP1.1 | v15.85,56.55 15.89,56.37 | v15.95,55.26 15.86,55.07 | v28.73,63.91 28.73,64.05 | IC102.12 19.52,51.7 19.52,50.39 IC102.10 | 28.15,42.89 28.15,42.88 | v26.38,43.45 26.4,43.47 | Q101.2 5.03,16.5 | v23.46,60.35 23.46,60.33 | R116.1 30.76,43.75 30.79,43.77
  Bottom 0.406: 21.89,28.05 19.22,28.05 16.44,28.07 | 19.14,17.91 22.54,17.93 | JTAG.10 18.37,17.29
  Bottom 0.61: 18.37,17.29 19.14,17.91
  Bottom 1.27: JTAG.6 16.7,11.3
  other vias: 10.25,34.56 2.56,34.59 2.88,51.18 10.01,51.05 13.15,80 28.99,82.52 48.56,21.03 49.02,10.53 49.3,17.71 49.16,15.82 38.01,82.79 30.68,79.83 11.22,2.73 47.3,21.01
  pour Bottom (rank 4): 50.35,83.96 50.62,83.91 50.49,0.43 50.32,0.37 0.62,0.33 0.62,0.51 0.29,84
  pour Top (rank 2): 41.11,22.64 41.07,24.82 41.68,26.44 41.41,26.97 40.94,27.35 40.57,27.19 40.56,26.5 40.48,25.65 39.49,25.63 39.37,24.62 39.28,23.53 39.79,22.76
  pour Top (rank 4): 0.2,0.04 50.85,0.04 50.86,84.21 0.05,84.22
  pour Bottom: 16.37,14.32 16.41,23.67 16.51,30 18.57,29.97 19.5,29.41 19.37,28.98 20.92,28.6 21.03,25.68 28.36,25.91 30.19,20.93 28.4,17.95 21.92,13.07
JTAG_R-TO-GND-11
  Bottom 0.203: R102.1 22.78,19.85 20.96,19.88 JTAG.11
JTAG_R-TO-GND-17
  Bottom 0.203: R106.2 22.7,26.7 20.8,26.7 JTAG.17
JTAG_R-TO-GND-19
  Bottom 0.203: R107.2 15.34,32.16 15.42,30.45 18.5,30.5 19.3,29.7 JTAG.19
JTDO  (via drill 0.6)
  Top 0.203: v24.54,16.45 25.2,15.81 R16.1 | v33.47,20.06 35.61,16.39 35.6,15.9 U1.55
  Bottom 0.203: 24.06,20.28 21.67,20.29 20.98,20.92 JTAG.13 | v24.54,16.45 24.54,20.76 24.06,20.28 | v33.47,20.06 33.68,19.84 27.57,21.05 24.78,21.03 24.06,20.28
JTRST  (via drill 0.6)
  Top 0.203: U1.56 36.1,14.5 36.1,14.3 35.61,13.11 35.85,7.16 34.84,6.16 28.33,6.11 28.3,6.1 | v26.93,8.71 26.93,7.01 28.3,6.1 | 28.3,6.1 R20.1
  Bottom 0.203: v26.93,8.71 20.8,8.7 JTAG.3
N$1
  Bottom 0.203: R117.2 25.67,48.53 25.09,49.13 25.09,52.16 25.55,52.34 26.74,52.34 IC102.4
N$2
  Bottom 0.203: IC102.3 27.86,52.99 28.43,53.65 28.83,56.13 29.82,56.17 R114.2
N$3
  Bottom 0.203: 23.53,42.16 JP100.P$1 23.5,43.55 18.13,48.45 13.33,49.23 13.09,50.5 13.14,56.93 17.66,60.19 | R21.2 17.66,61.54 17.66,60.19 | L2.1 20.31,60.57 17.66,60.19
NRST  (via drill 0.6)
  Top 0.203: U1.7 48.01,20.13 48.31,19.86 49.62,19.39 50.19,18.03 50.2,4.3 46.86,0.87 18.71,0.88 16.83,1.3 15.79,1.94 15.44,2.87 15.18,14.59 15.01,15.13 15.2,15.81 15.52,16.02 v15.67,23.09 15.69,23.12 14.02,22.08 9.92,22.11 SW1.P$2 5.83,21.56 SW1.P$1
  Bottom 0.203: R104.1 21.52,23.3 20.8,24 JTAG.15 19.57,23.87 18.62,23 15.72,23 v15.67,23.09
PA3_ADC123_IN3|THERMISTOR_32KHZ
  Top 0.203: U1.29 34.1,27.6 34.31,28.17 34.31,30.73 31.1,37.94 31,40.11 30.98,40.13 | 30.98,40.13 THRM1.1 | 30.98,40.13 31.13,39.86 33.08,39.89 C9.1 32.98,40.07 33.02,39.8 33.1,39.03 R11.1
PA4_EEPROM_/CS  (via drill 0.6)
  Top 0.203: U1.20 38.51,24.67 37.76,22.51 37.69,21.43 v37.88,20.08
  Bottom 0.203: IC100.1 44.11,19.55 43.57,20.02 42.78,20.14 40.25,20.54 38.95,20.54 v37.88,20.08
PA5_EEPROM_SCK  (via drill 0.6)
  Top 0.203: v38.34,28.13 38.1,27.3 U1.21
  Bottom 0.203: v38.34,28.13 39.54,25.58 42.27,25.51 42.79,24.9 IC100.6
PA6_EEPROM_SI  (via drill 0.6)
  Top 0.203: v37.28,24.61 37.1,25.34 37.12,25.34 U1.23
  Bottom 0.203: v37.28,24.61 41.89,25.08 IC100.5
PA7_EEPROM_SO  (via drill 0.6)
  Top 0.203: v38.48,32.76 38.42,32.34 38.31,30.88 38,29.13 37.61,28.55 37.48,28.39 37.47,28.04 37.58,27.55 37.58,26.57 U1.22
  Bottom 0.203: IC100.2 43.49,17.56 43.91,17.31 46.93,17.31 48,18 48.78,18.54 49.48,19.53 49.55,21.85 48.66,23.06 49.05,31.45 49.04,32.07 48.46,32.54 46.53,33.43 45.47,33.78 44.15,33.87 v38.48,32.76
PA9_USART1_TX  (via drill 0.6)
  Top 0.203: v29.06,21.71 29.1,20.55 29.52,20.12 U1.42 | v25.77,23.72 25.7,23.8 25.7,28.4 26.5,29.2 JP1.5
  Bottom 0.203: v29.06,21.71 28.37,22.18 27.42,23.57 26.23,23.58 v25.77,23.72
PA10_USART1_RX
  Top 0.203: JP1.4 27.1,26.6 28,25.7 28,24.16 27.98,23.84 28.06,23.15 28.04,21.57 28.46,21.02 28.67,20.23 29.11,19.61 U1.43
PA11_CANRXD  (via drill 0.6)
  Top 0.203: v24.28,38.17 24.6,37.8 24.9,37.07 24.9,21.2 27.5,21.2 28,20.7 28.25,19.42 29.22,19.11 U1.44 30.7,19.12
  Bottom 0.203: v24.28,38.17 23,38.2 IC101.4
PA12_CANTXD  (via drill 0.6)
  Top 0.203: v23.87,35.73 23.9,35.8 23.87,35.7 24.4,35.31 24.38,20.75 25.06,18.9 25.87,18.37 27.21,18.28 28.06,18.56 28.46,18.61 29.02,18.62 U1.45
  Bottom 0.203: IC101.1 19.05,37.54 23.87,35.69 v23.87,35.73
PA13_JTIMS  (via drill 0.6)
  Top 0.203: v23.28,12.92 24.7,11 R17.1 | v27.15,12.88 27.23,13.05 | 27.23,13.05 26.88,12.87 | 27.23,13.05 26.72,13.62 26.7,16.4 28.28,18.13 U1.46 | U1.46 | U1.46
  Bottom 0.203: JTAG.7 20.8,13.7 21.68,13.2 v23.28,12.92 23.64,12.94 25.93,12.82 v27.15,12.88
PA14_JTCK  (via drill 0.6)
  Top 0.203: R18.1 28.79,11.62 29.03,12.21 v29.43,12.87 31.17,13.88 32.43,14.02 32.62,14.21 32.62,15.13 U1.49
  Bottom 0.203: v29.43,12.87 27.03,13.9 23.89,13.94 22.8,13.96 21.83,14.23 20.95,15.26 20.45,16 JTAG.9
PA15_JTDI  (via drill 0.6)
  Top 0.203: R19.1 24.7,6.3 22.17,8.83 20.76,10.93 JTAG.5 | v28.4,7.8 29.2,7.8 30.4,9 30.4,12.4 31.33,13.24 32.79,13.48 33.11,13.91 33.13,15.11 U1.50
  Bottom 0.203: v28.4,7.8 19.5,7.8 18.78,8.38 18.76,10.37 19.39,11.06 JTAG.5
PAB13_SPI2_SCK_AD7799_SCK  (via drill 0.6)
  Top 0.203: U1.34 29.85,24.1 29.58,24.3 29.62,33.2 28.05,34.65 26.28,39.45 22.19,45.53 22.26,47.07 23.32,50.69 23.48,51.02 v23.46,51.02 23.46,51.59 23.45,51.59 IC1.1 23.6,52.4
  Bottom 0.203: v23.46,51.02 23.8,52.81 24.82,54.28 IC102.1
PB0_CAN_VREF  (via drill 0.6)
  Top 0.203: U1.26 35.61,27.45 36.08,28.27 36.32,29.72 36.42,33.58 v37.22,34.77
  Bottom 0.203: v37.22,34.77 35.51,35.43 33.04,36.01 30.84,36.39 30.43,36.84 29.22,36.85 27.64,36.88 26.89,36.86 26.15,36.77 25.44,36.3 25.19,35.78 25.18,34.6 24.69,33.95 24.25,33.75 22.8,33.79 IC101.5
PB1
  Top 0.203: U1.27 35.12,27.52 35.22,27.86 35.25,28.03 35.37,28.23 35.48,28.53 S1.P$1
PB2_BOOT1
  Top 0.203: U1.28 34.61,27.61 34.74,28.14 34.77,30.08 35.31,30.41 35.3,30.75 R13.2
PB5_LED  (via drill 0.6)
  Top 0.203: U1.57 36.61,14.07 36.32,13.18 36.66,11.2 37.06,9.6 37.09,2.42 20.57,2.43 v19.59,3.5
  Bottom 0.203: Q100.1 11.23,14.72 11.29,14.69 11.41,14.07 15.23,4.85 16.54,4.25 18.07,4.08 18.59,4.02 v19.59,3.5
PB6_LED_GREEN  (via drill 0.6)
  Top 0.203: U1.58 37.11,13.89 36.89,13.24 37.09,11.27 37.52,9.62 37.57,1.89 19.06,1.88 v18.15,3.19 | v14.57,4.35 14.19,7.38 9.08,12.4 5.09,13.01 v4.13,14.29
  Bottom 0.203: Q101.1 6.9,16.26 6.87,15.73 5.83,15.44 5.86,14.79 R101.2 6.34,14.34 v4.13,14.29 | v14.57,4.35 v18.15,3.19
PB7_CAN_RS  (via drill 0.6)
  Top 0.203: 38.07,1.37 19.05,1.39 17.13,2.42 v16.83,2.67 | v16.34,31.39 13.11,31.25 12.82,30.79 12.81,28.05 12.8,25.26 5.45,24.73 1.57,24.43 1.57,16.24 2.96,12.85 8.74,11.91 13.18,7.74 13.24,3.57 v13.29,3.66 | U1.59 37.6,15.9 37.62,14.15 37.59,13.78 37.38,13.22 37.56,11.36 37.89,10.24 38.05,9.61 38.07,1.37 | 38.07,1.37 38.05,1.39
  Bottom 0.203: v16.34,31.39 19.1,32.7 IC101.8 | v13.29,3.66 13.53,3.67 14.4,3.22 16.11,2.8 16.6,2.81 v16.83,2.67
PB11_AD7799_1_/CS  (via drill 0.6)
  Top 0.203: U1.30 33.57,27.63 33.87,28.27 33.88,30.38 30.29,33.85 28.92,35.21 27.12,39.87 24.85,43.24 | 24.85,43.24 23.91,44.74 | v24.56,48.13 23.84,45 24.08,44.51 24.85,43.24
  Bottom 0.203: IC102.2 25.53,53.65 24.42,52.11 24.45,49.03 v24.56,48.13
PB12_AD7799_2_/CS
  Top 0.203: U1.33 30.03,24.62 30.05,33.41 28.46,34.88 26.71,39.63 22.77,45.61 22.85,46.79 24.99,52.07 24.34,53.08 IC1.2
PB14_SPI2_MISO_AD7799_DOUT/RDY  (via drill 0.6)
  Top 0.203: U1.35 29.63,23.62 29.12,24.12 29.16,33.01 27.63,34.42 25.85,39.27 19.33,48.7 19.4,50.26 19.31,51.98 19.31,53.1 | IC1.15 18.75,53.1 19.31,53.1 | 19.31,53.1 v19.31,53.56
  Bottom 0.203: IC102.15 19.78,53.62 v19.31,53.56
PB15_PWRLED  (via drill 0.6)
  Top 0.203: 11.35,23.52 U$5.C v9.29,23.52
  Bottom 0.203: R105.2 6.49,24.28 8.5,24.28 v9.29,23.52
PB15_PWRLED_D
  Bottom 0.203: Q101.3 5.96,20.92 6.44,21.11 6.53,21.8 R105.1
PB15_SPI1_MOSI_AD7799_DIN  (via drill 0.6)
  Top 0.203: U1.36 29.26,23.13 28.67,23.88 28.61,32.86 27.14,34.2 25.4,39.05 18.29,49.14 17.65,50.62 | 17.65,50.62 17.59,52.49 IC1.16 16.7,52.45 v15.69,52.03 | 17.65,50.62 17.65,50.5
  Bottom 0.203: v15.69,52.03 15.23,52.74 15.04,53.56 15.2,54.01 15.8,54.41 16.88,54.23 18.98,54.43 19.59,54.38 20.01,54.24 20.75,54.23 IC102.16
PC5_LED2  (via drill 0.6)
  Top 0.203: U$8.C 11.32,17.45 v13.25,17.43
  Bottom 0.203: R103.2 13.31,20.07 v13.25,17.43
PC5_LED_D
  Bottom 0.203: Q100.3 10.54,17.97 R103.1
PD0_OSC_IN_XTAL
  Top 0.203: U1.5 43.42,19.11 44.27,18.53 45.11,17.07 45.11,15.99 44.49,15.63 43.7,15.48 43.75,14.78 R15.1 43.75,14.73 42.65,14.73 42.65,13.58 | C14.1 42.65,13.58 | X2.MP 46.47,13.6 42.92,13.6 42.65,13.58
PD1_OSC_OUT
  Top 0.203: U1.6 44.05,19.62 45.49,18.64 46.05,17.08 R14.1
PD1_OSC_OUT_XTAL
  Top 0.203: X1.MP 47.73,18.17 47.84,17.06 R14.2 47.73,16.09 47.52,16.05 | 47.52,16.05 45.9,15.73 R15.2 | C15.1 49.31,12.38 49.35,13.83 48.11,15.41 47.52,16.07 47.52,16.05
V+  (via drill 0.6)
  Top 0.203: U1.13 43.95,23.11 45.34,23.82 | C13.1 45.96,23.63 45.34,23.82 | 45.34,23.82 45.98,23.9 v45.98,24.79 | v48.21,31.68 47.79,34.18 v42.84,36.02 42.88,35.99 40.95,35.97 38.1,37.47 R11.2
  Bottom 0.203: L1.2 48.17,40.78 43.13,40.95 42.69,40.28 41.68,40.31 | R1.1 41.72,41.32 41.68,40.31 | 41.68,40.31 C113.1 41.43,39.1 42.44,38.95 42.4,37.62 v42.84,36.02 | v45.98,24.79 46,25.02 47.84,27.63 v48.21,31.68
VCC  (via drill 0.6, 0.9)
  Top 0.203: 26.1,4.2 28.3,4.2 R20.2 | 26.1,4.2 25.7,4.2 R19.2 | 26.1,4.2 26.1,8 | 25.7,12.2 27.15,10.75 28.08,8.95 | R16.2 25.7,12.8 | R17.2 25.31,8.75 | v15.96,15.33 16.3,8 17.1,7.2 JTAG.2 | 20.8,4.6 20.8,5.7 JTAG.1 | v39.04,29.38 39.19,28.24 39.14,27.86 39.1,27.3 U1.19 39.1,25.9 | v32.79,29.78 31.93,29.21 31.74,28.43 31.93,27.71 32.61,27.3 U1.32 | 40.7,17.1 40.7,16.4 40.2,15.9 U1.64 | 40.7,17.1 40.72,21.5 | 40.7,17.1 41.4,17.1 U1.1 42.5,17 42.49,16.49 v41.98,15.95 | v39.73,18.57 39.5,18.56 | 23.01,14.7 23.01,25.83 v22.43,30.53 | v41.72,44.45 41.7,44.57 | v16.03,53.5 15.95,53.72 | v19.75,43.41 19.74,43.43 | v13.64,14.29 13.71,14.33 13.72,14.34 U$8.A 11.31,14.22 9.36,14.13 v9.27,14.15 | U$5.A 13.83,20.3 | v15.61,50.53 15.56,50.52
  Bottom 0.203: JTAG.2 18.3,6.5 19.3,6.5 JTAG.1 | v15.96,15.33 15.8,15.1 v13.64,14.29 | v39.04,29.38 37.64,29.86 C105.1 37.3,30.3 34.57,30.26 | v32.79,29.78 33.4,30.3 34.57,30.26 | v41.98,15.95 41.8,16.16 | 34.57,30.26 34.22,33.57 v33.94,34.58 33.5,35.1 32.5,35.44 30.03,35.43 28.76,33.94 28.07,31.93 27.3,31.3 24.9,31.3 v22.43,30.53 | 33.55,34.84 33.95,33.65 | IC100.8 44.16,24.13 IC100.7 43.57,23.86 43.43,22.79 v38.72,22.21 38.75,22.2 C102.1 | 19.47,42.19 JP100.P$3 19.38,43.04 v19.75,43.41 | C2.+ 34.18,75.79 36.31,76.36 | 35.35,74.31 35.56,74.34 36.63,74.58 | 32.4,24.4 v32.65,24.34 C103.1 | v22.93,21.11 23.91,21.35 R104.2 | L1.1 41.78,43.59 R1.2 v41.72,44.45 | v16.03,53.5 17.6,53.21 18.3,53.11 18.97,52.71 19.52,52.69 19.91,52.96 IC102.14 | R101.1 v9.27,14.15 | C12.1 v15.61,50.53
  Bottom 0.305: v41.98,15.95 42.3,14.79 C100.1
  Bottom 0.406: v39.73,18.57 40.69,17.08 41.8,16.16 | IC103.P$2 34.13,71.45
  Bottom 0.813: 34.13,71.45 35.31,71.97 35.35,74.31 34.2,75.75 C2.+
  other vias: 30.78,35.27
  pour Bottom (rank 3): 21.9,30.71 21.9,30.44 arc90 22.3,30.04 22.71,30.04 26.38,30.71 27.58,30.71 28.77,31.71 30.78,34.64 31.51,34.65 32.98,34.58 33.7,33.4 34.07,32.74 34.1,30.58 32.61,30.56 32.35,29.63 32.68,29.27 33.88,29.51 37.13,29.47 37.81,29.03 39.03,28.95 39.41,29.51 38.64,30.24 38.09,30.34 37.31,30.31 35.35,30.35 35.28,31.3 34.65,35.25 34.02,35.34 32.07,35.74 30.59,35.91 28.34,35.96 27.45,33.65 27.39,32.07 27.15,31.74 26.19,31.82 24.84,31.88 22.79,31.27 22.32,31.14
  pour Top (rank 3): 32.78,2.32 13.3,2.22 13.48,67.52 32.11,77.91 36.91,77.97 42.94,70.39 43.69,15.3
VSS_1  (via drill 0.6)
  Top 0.203: v32.69,28.45 33.1,27.3 U1.31
  Bottom 0.203: 31.7,28.6 C104.1
  Bottom 0.305: v32.69,28.45 31.7,28.6
VSS_2  (via drill 0.6 pad 0.3)
  Top 0.203: U1.47 29.5,17.62 28.88,17.26 v28.63,16.1
  Bottom 0.203: v28.63,16.1 28.44,15.96 28.87,15.32 C101.1

### Text on the board
tNames: DIGITAL | 3.3V
bNames: 5 | 5 | 3.3
tValues: 3.3V | DIGITAL | +5V | 3.2v | ANALOG | 3.2